# EasyEDA schematic SCH_Multiple_Radio_2026-09-24.json

## Sheets
1 Sheet_1: TITLE: Sheet_1; REV: 1.0; Date: 2026-09-23; Sheet: 1/1; Drawn By: meneses.francisco; Company: Your Company
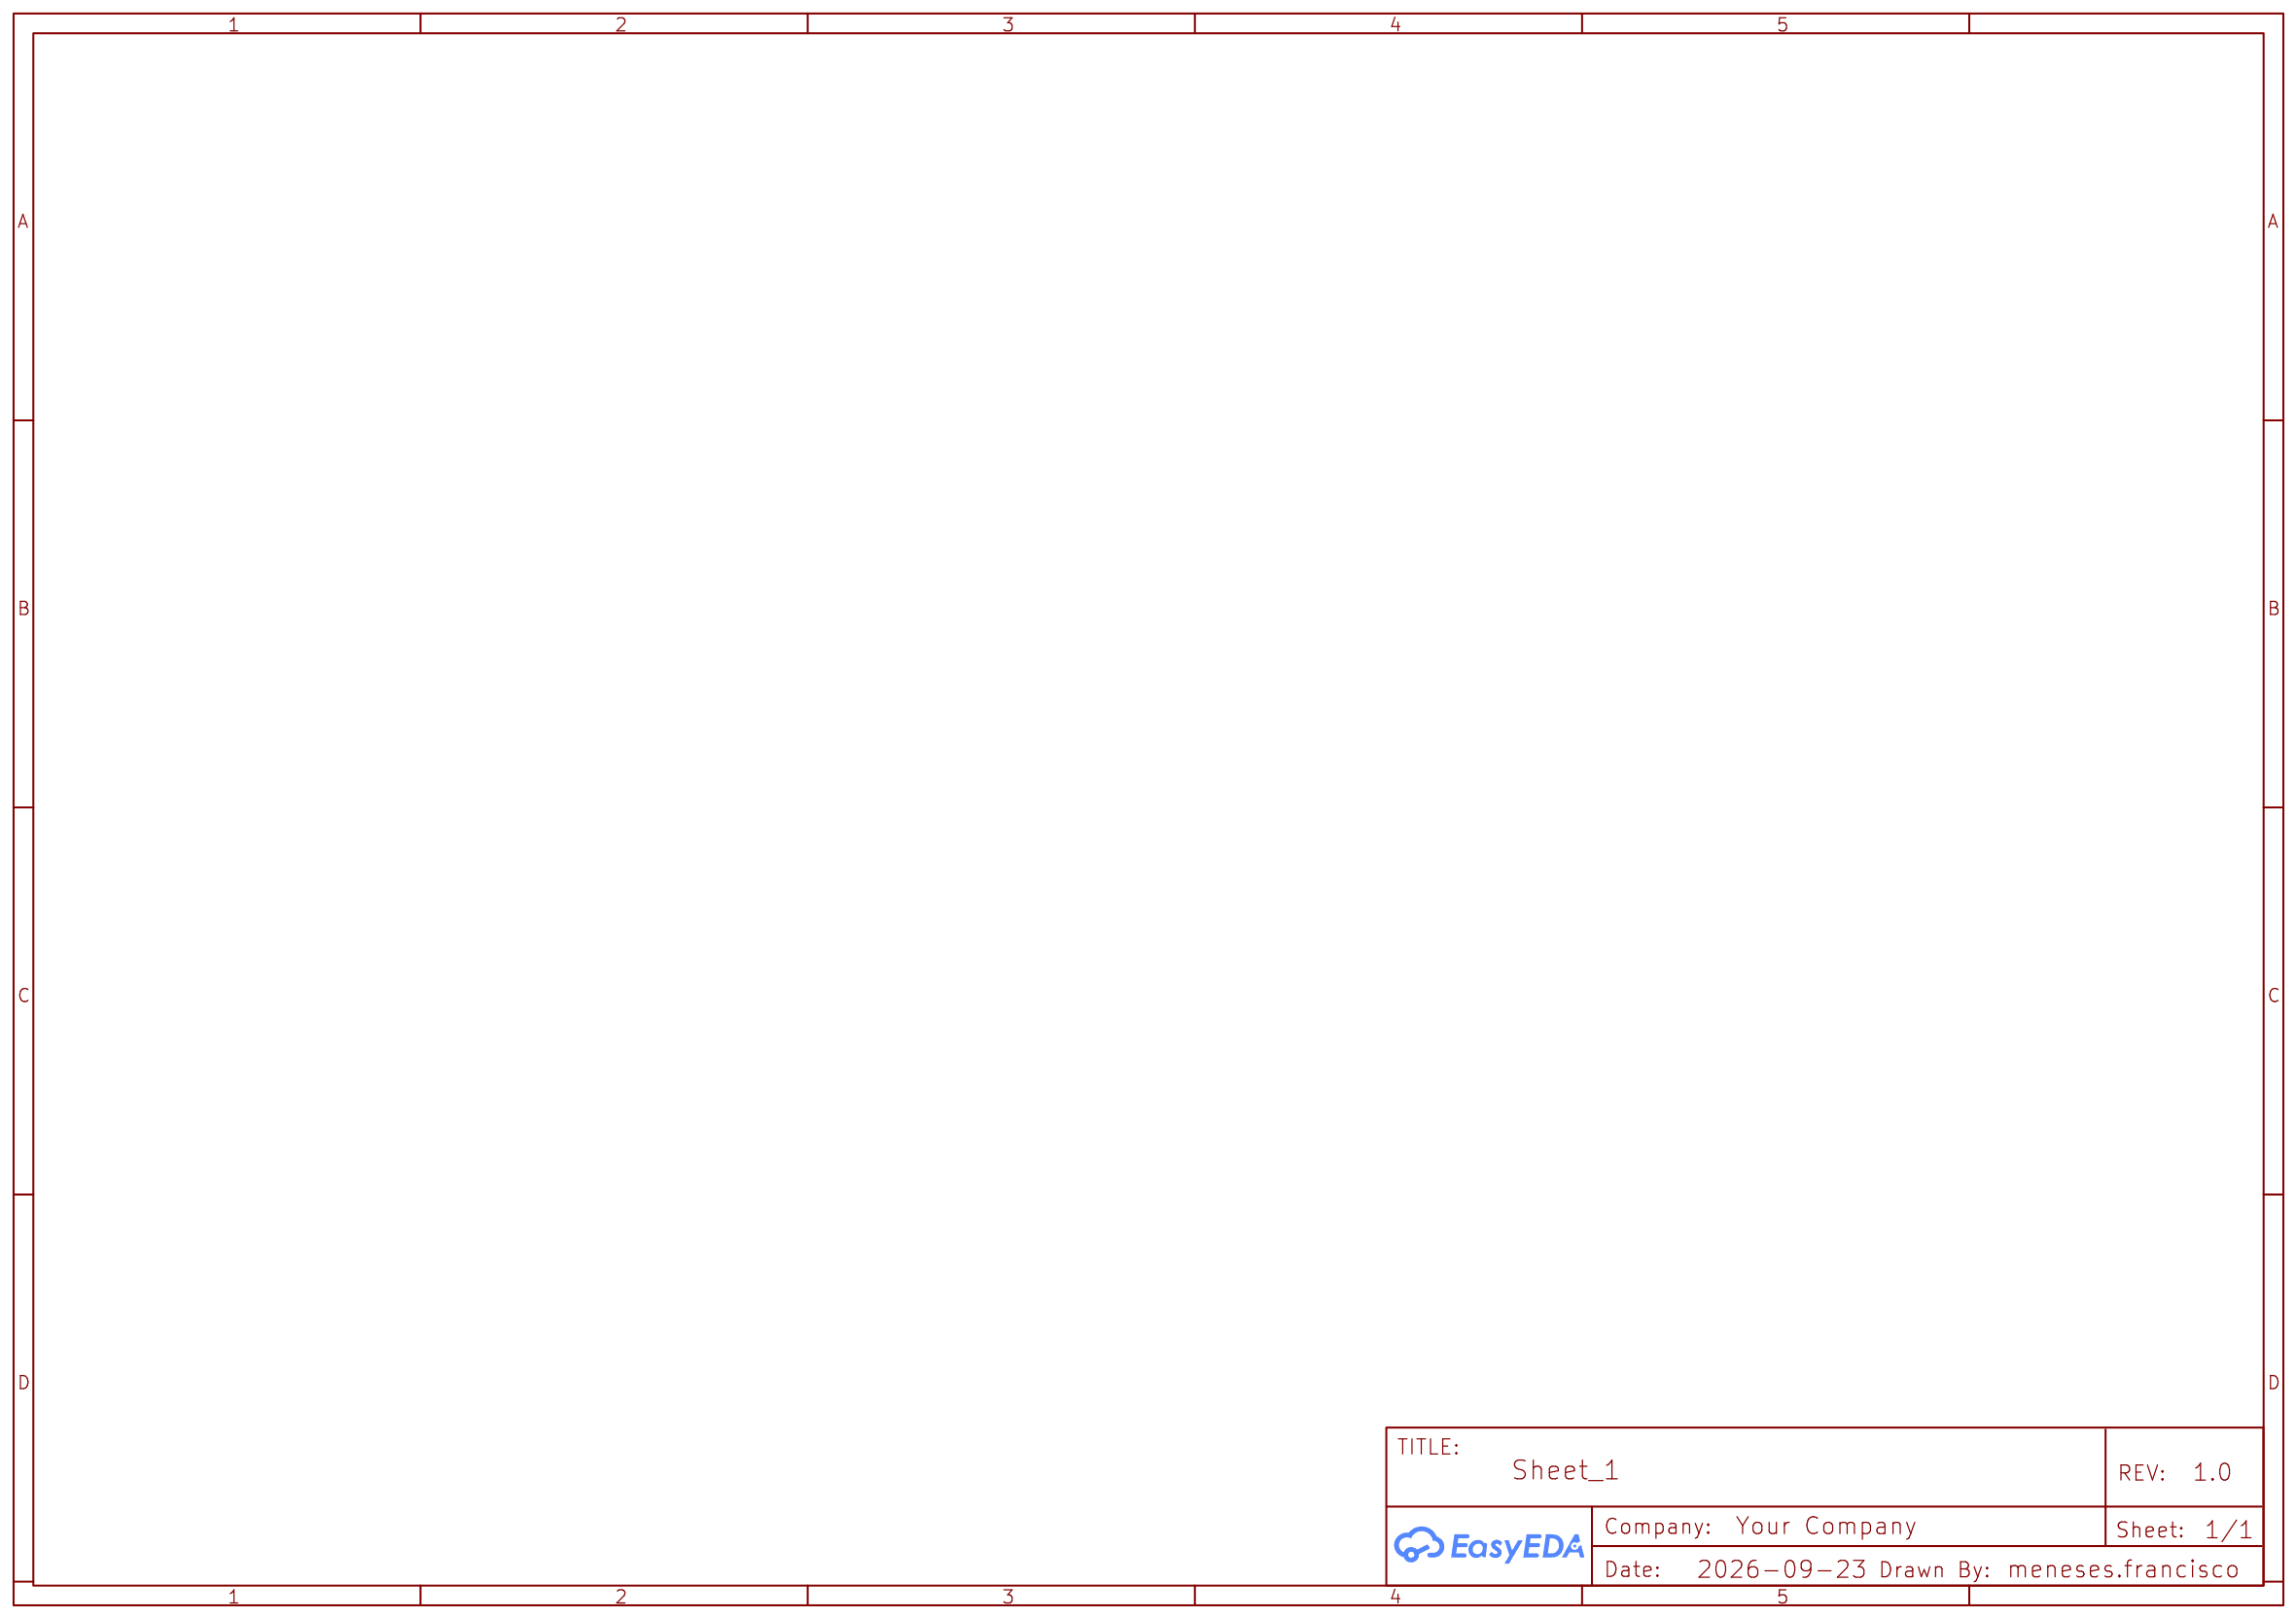
[diagram p0: Sheet_1]
2 dongle_rev2 UART
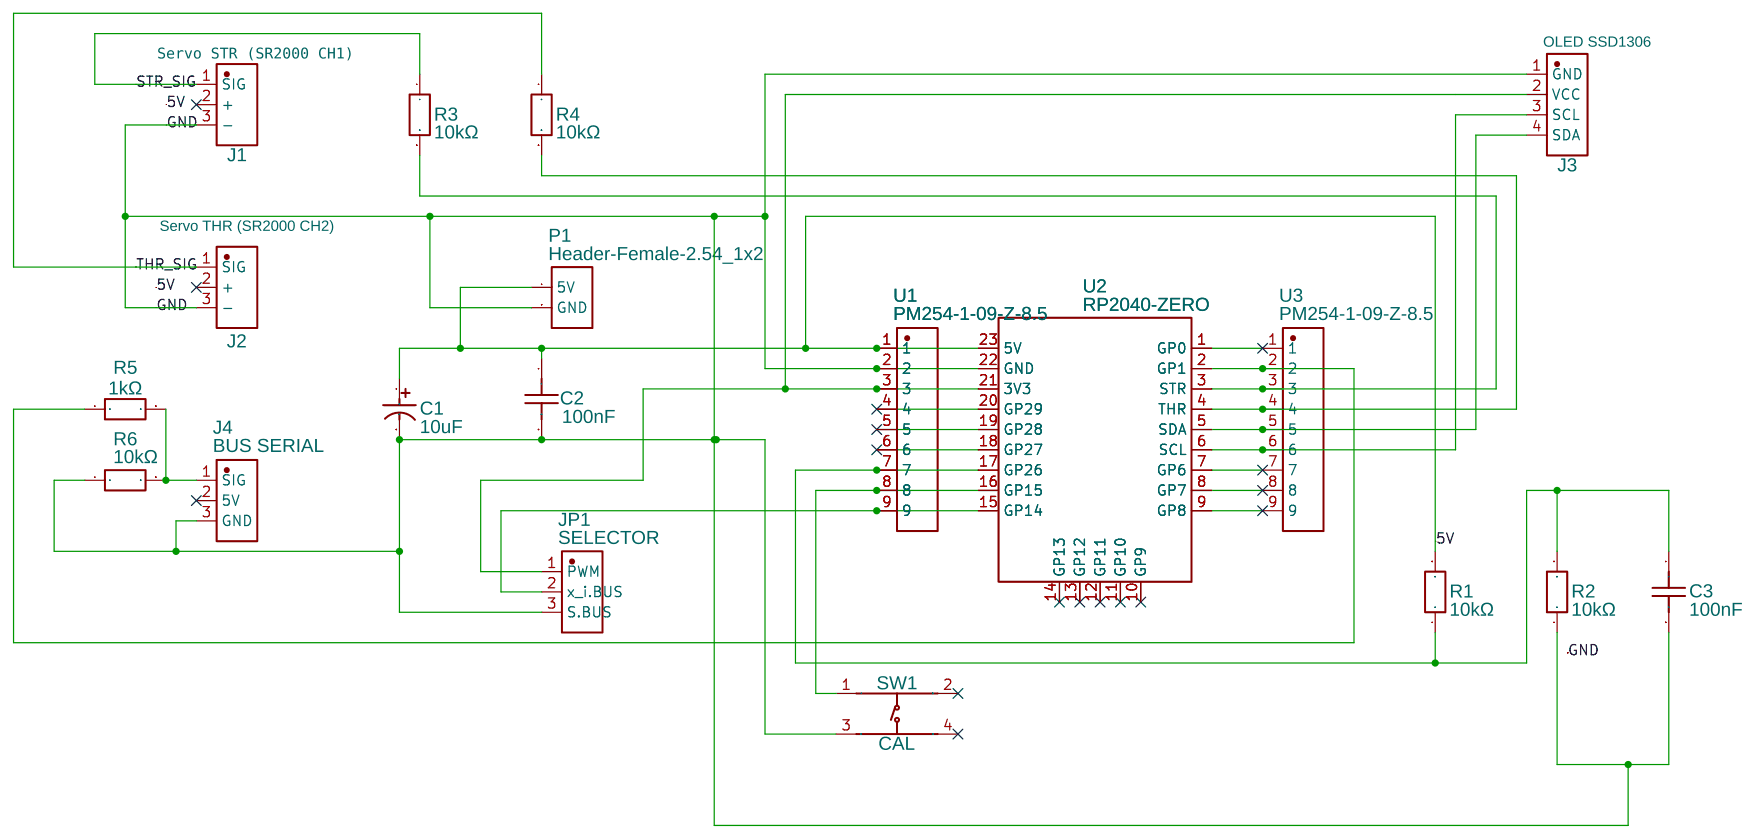
[diagram p1: dongle_rev2 UART]

## Parts
C1  10uF  [CAP-TH_BD4.0-P1.50-D0.8-FD]
C2  100nF  [CAP-TH_L5.8-W2.4-P2.54-D0.6]
C3  100nF  [CAP-TH_L5.8-W2.4-P2.54-D0.6]
J1  Servo STR (SR2000 CH1)  [HDR-TH_3P-P2.54-V-F]
J2  Servo THR (SR2000 CH2)  [HDR-TH_3P-P2.54-V-F]
J3  OLED SSD1306  [HDR-TH_4P-P2.54-V-F]
J4  BUS SERIAL  [HDR-TH_3P-P2.54-V-F]
JP1  SELECTOR  [HDR-TH_3P-P2.54-V-M]
P1  Header-Female-2.54_1x2  [HDR-TH_2P-P2.54-V-F]
R1  10kΩ  [RES-TH_BD2.7-L6.2-P10.20-D0.4]
R2  10kΩ  [RES-TH_BD2.7-L6.2-P10.20-D0.4]
R3  10kΩ  [RES-TH_BD2.7-L6.2-P10.20-D0.4]
R4  10kΩ  [RES-TH_BD2.7-L6.2-P10.20-D0.4]
R5  1kΩ  [RES-TH_BD2.3-L6.5-P10.50-D0.5]
R6  10kΩ  [RES-TH_BD2.7-L6.2-P10.20-D0.4]
SW1  CAL  [SW-TH_4P-L6.0-W6.0-P4.50-LS6.5]
U1  PM254-1-09-Z-8.5  [HDR-TH_9P-P2.54-V-F]
U2  RP2040-ZERO  [COMM-SMD_RP2040-ZERO]
U3  PM254-1-09-Z-8.5  [HDR-TH_9P-P2.54-V-F]

## Library data of the parts
C1 = 10uF 25V 4*5: Supplier: LCSC; Manufacturer: Chengx(承兴); Manufacturer Part: KF106M025C05RR0VH2FP0; Supplier Part: C43846; JLCPCB Part Class: Extended Part
C2 C3 = CC1H104ZA1ED3F5P1100: Contributor: LCSC; Supplier: LCSC; Supplier Part: C2832506; Manufacturer: Dersonic(德尔创); JLCPCB Part Class: Extended Part
J1 J2 J4 = PM254V-11-03-H85: Contributor: LCSC; Supplier: LCSC; Supplier Part: C541850; Manufacturer: XFCN(兴飞); JLCPCB Part Class: Extended Part
J3 = 2.54-1*4P母: Contributor: LCSC; Supplier: LCSC; Supplier Part: C2718488; Manufacturer: BOOMELE(博穆精密); JLCPCB Part Class: Extended Part
JP1 = HB-PH3-25413PB2GOP: Supplier: LCSC; Supplier Part: C6332196; Manufacturer: HANBO(汉博); JLCPCB Part Class: Extended Part; Contributor: lcsc
P1 = Header-Female-2.54_1x2: Supplier: LCSC; Manufacturer: BOOMELE(博穆精密); Manufacturer Part: 2.54-1*2P母; Supplier Part: C49661; JLCPCB Part Class: Extended Part
R1 R2 R6 = MF1/4W-10K±1%-ST52: Contributor: lcsc; Supplier: LCSC; Supplier Part: C2903232; Manufacturer: VO(翔胜); JLCPCB Part Class: Extended Part
R3 R4 = MF1/4W-10K±1%-ST52: Contributor: lcsc; Supplier: LCSC; Supplier Part: C2903232; Manufacturer: VO(翔胜); JLCPCB Part Class: Extended Part; link: https://lcsc.com/eda_search?q=C2903232&%26type=1&ref=editor
R5 = MF1/4W-1KΩ±1%T52: Contributor: LCSC; Supplier: LCSC; Supplier Part: C713997; Manufacturer: 华星机电; JLCPCB Part Class: Extended Part
SW1 = TS665CJ: Contributor: LCSC; Supplier: LCSC; Supplier Part: C393938; Manufacturer: SHOU HAN(首韩); JLCPCB Part Class: Extended Part
U1 U3 = PM254-1-09-Z-8.5: Contributor: LCSC; Supplier: LCSC; Supplier Part: C2897372; Manufacturer: HCTL(华灿天禄); JLCPCB Part Class: Extended Part
U2 = RP2040-ZERO: Supplier: LCSC; Supplier Part: C5350143; Manufacturer: Waveshare(微雪电子); Manufacturer Part: RP2040-Zero; Contributor: lcsc; JLCPCB Part Class: Extended Part

## Nets
5V: C1.1 C2.1 P1.1(5V) R1.2 U1.1 U2.23(5V)
GND: C1.2 C2.2 C3.2 J1.3(-) J2.3(-) J3.1(GND) J4.3(GND) JP1.3(S.BUS) P1.2(GND) R2.1 R6.1 SW1.3(C) U1.2 U2.22(GND)
STR_SIG: J1.1(SIG) R3.1
THR_SIG: J2.1(SIG) R4.1
Net-(C3-1): C3.1 R1.1 R2.2 U1.7 U2.17(GP26)
Net-(J3-2): J3.2(VCC) JP1.1(PWM) U1.3 U2.21(3V3)
Net-(J3-3): J3.3(SCL) U2.6(SCL) U3.6
Net-(J3-4): J3.4(SDA) U2.5(SDA) U3.5
Net-(J4-1): J4.1(SIG) R5.2 R6.2
Net-(JP1-2): JP1.2(x i.BUS) U1.9 U2.15(GP14)
Net-(R3-2): R3.2 U2.3(STR) U3.3
Net-(R4-2): R4.2 U2.4(THR) U3.4
Net-(R5-1): R5.1 U2.2(GP1) U3.2
Net-(SW1-1): SW1.1(A) U1.8 U2.16(GP15)
Net-(U1-4): U1.4 U2.20(GP29)
Net-(U1-5): U1.5 U2.19(GP28)
Net-(U1-6): U1.6 U2.18(GP27)
Net-(U2-1): U2.1(GP0) U3.1
Net-(U2-7): U2.7(GP6) U3.7
Net-(U2-8): U2.8(GP7) U3.8
Net-(U2-9): U2.9(GP8) U3.9

Not connected (* = marked no-connect by the designer): J1 2(+)*; J2 2(+)*; J4 2(5V)*; SW1 2(B)* 4(D)*; U2 10(GP9)* 11(GP10)* 12(GP11)* 13(GP12)* 14(GP13)*
